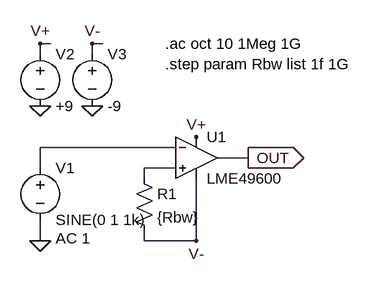
[diagram p0: schematic LME49600.asc]
LME49600.asc, the LTspice schematic file:
Version 4
SHEET 1 880 680
WIRE 64 0 48 0
WIRE 144 0 128 0
WIRE 48 16 48 0
WIRE 128 16 128 0
WIRE 256 160 48 160
WIRE 368 176 320 176
WIRE 48 192 48 160
WIRE 256 192 208 192
WIRE 208 208 208 192
WIRE 48 304 48 272
WIRE 208 304 208 288
WIRE 288 304 288 208
WIRE 288 304 208 304
FLAG 48 304 0
FLAG 48 96 0
FLAG 128 96 0
FLAG 48 0 V+
FLAG 128 0 V-
FLAG 288 144 V+
FLAG 288 304 V-
FLAG 368 176 OUT
IOPIN 368 176 Out
SYMBOL Opamps\\LME49600 288 112 R0
SYMATTR InstName U1
SYMBOL voltage 48 176 R0
WINDOW 123 24 124 Left 2
WINDOW 39 0 0 Left 2
SYMATTR Value2 AC 1
SYMATTR InstName V1
SYMATTR Value SINE(0 1 1k)
SYMBOL voltage 48 0 R0
WINDOW 123 0 0 Left 2
WINDOW 39 0 0 Left 2
SYMATTR InstName V2
SYMATTR Value +9
SYMBOL voltage 128 0 R0
WINDOW 123 0 0 Left 2
WINDOW 39 0 0 Left 2
SYMATTR InstName V3
SYMATTR Value -9
SYMBOL res 192 192 R0
SYMATTR InstName R1
SYMATTR Value {Rbw}
TEXT 240 0 Left 2 !.ac oct 10 1Meg 1G
TEXT 240 32 Left 2 !.step param Rbw list 1f 1G

The netlist it stands for:
* LME49600.asc
XU1 N002 N001 V+ V- OUT LME49600  ; pins In+ In- V+ V- OUT
V1 N001 0 SINE(0 1 1k) AC 1
V2 V+ 0 +9
V3 V- 0 -9
R1 N002 V- {Rbw}
.ac oct 10 1Meg 1G
.step param Rbw list 1f 1G
.backanno
.end